# EasyEDA Pro project Avian.epro, board PCB1_1
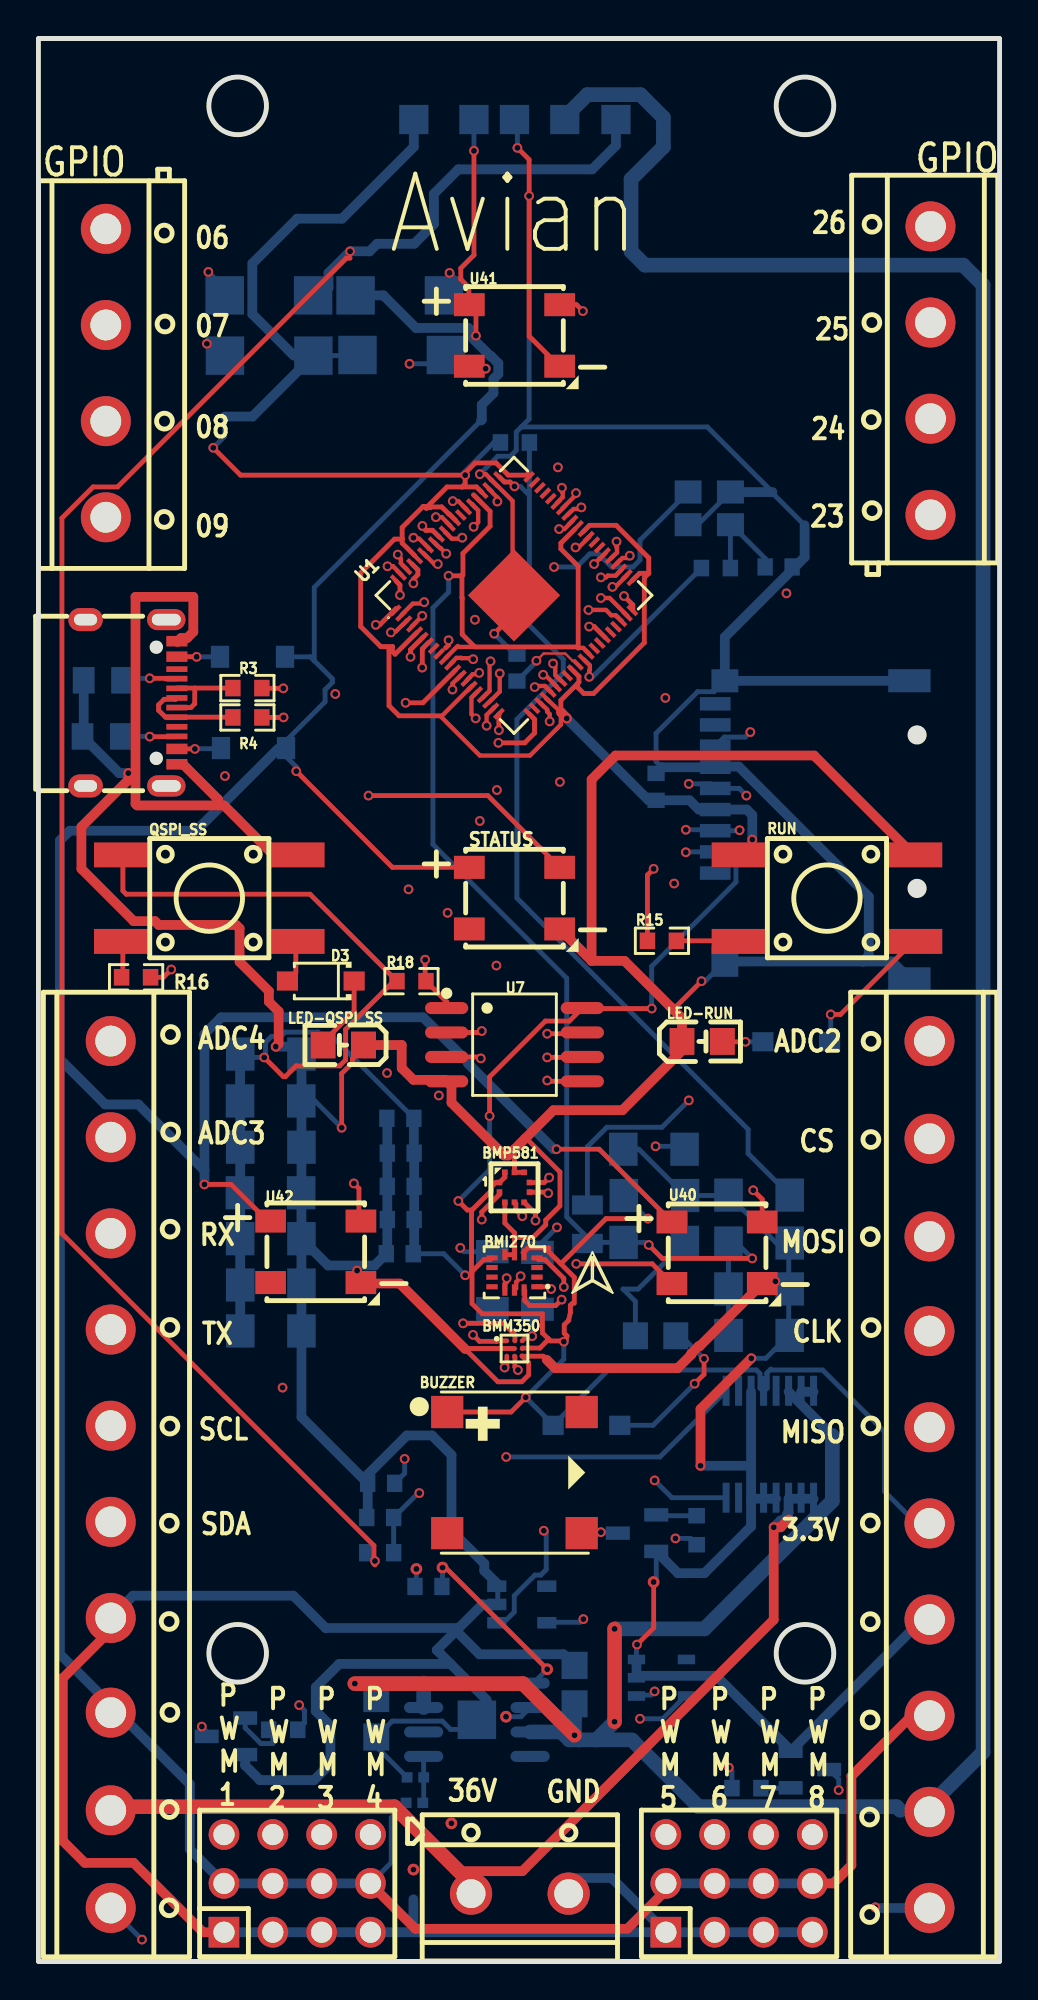
[diagram p2: board, top side]
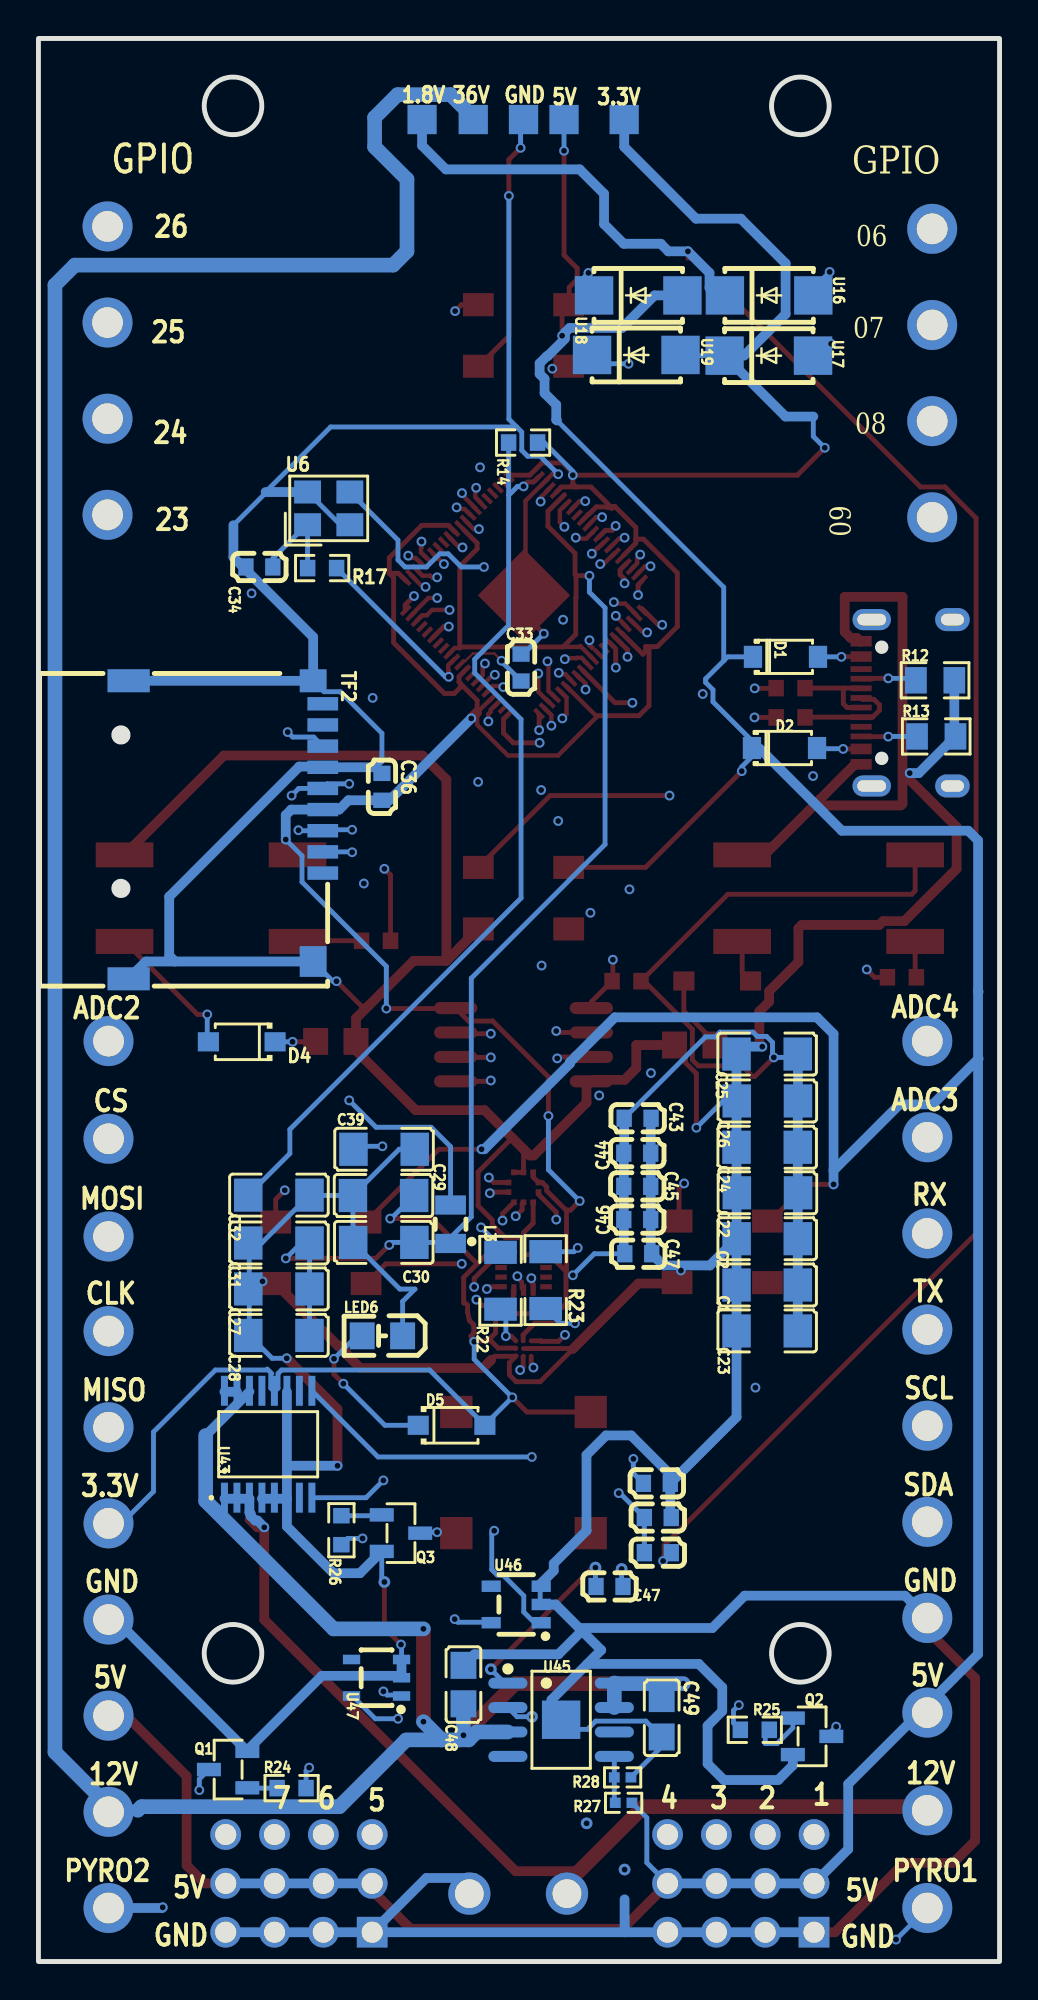
[diagram p3: board, bottom side, seen from below]

Outline 50 x 100 mm; copper layers: Top Layer, Inner1, Inner2, Inner3, Inner4, Bottom Layer. Coordinates in mm from the lower left corner of the outline.
Outline path: rectangle 0,100 50,0 ; circle c10.36,96.5 r1.5 ; circle c10.36,16.03 r1.5 ; circle c39.88,96.5 r1.5 ; circle c39.88,16.03 r1.5
Stack: Top Layer 0.035mm Outer layer thickness 1oz / Dielectric1 0.0994mm 3313 RC57% 4.2mil / Inner1 0.0152mm Inner layer thickness / Dielectric2 0.55mm 0.55mm H/H No copper / Inner2 0.0152mm Inner layer thickness / Dielectric3 0.1088mm 2116 RC54% 4.9mil / Inner3 0.0152mm Inner layer thickness / Dielectric4 0.55mm 0.55mm H/H No copper / Inner4 0.0152mm Inner layer thickness / Dielectric5 0.0994mm 3313 RC57% 4.2mil / Bottom Layer 0.035mm Outer layer thickness 1oz

## Design rules (mm)
template: JLCPCB Capability(Two Layers Board)
spacing copperThickness1oz (default): track to track 0.102, other pairs 0.152 to 0.3
spacing copperThickness2oz: track to track 0.203, other pairs 0.152 to 0.3
track width copperThickness1oz (default): min 0.127, default 0.254, max 2.54
track width copperThickness2oz: min 0.203, default 0.254, max 2.54
differential pair differentialPair (default): width min 0.127, default 0.254, max 2.54; gap min 0.152, default 0.152
via viaSize (default): diameter min 0.5, default 0.61, max 10; hole min 0.3, default 0.305, max 6.3

## Placement (name value [footprint] x y rotation side)
BMI270  BMI270  [LGA-14_L3.0-W2.5-P0.50-BR]  24.76 35.84 0 top
BMM350  BMM350  [WLCSP-9_L1.3-W1.3-R3-C3-P0.40-TL]  24.76 31.88 0 top
BMP581  BMP581  [LGA-10_L2.0-W2.0-P0.50-TL_BMP581]  24.76 40.26 0 top
BUZZER  2.7kHz  [BUZ-SMD_4P-L7.5-W7.5-P7.59-TL]  24.76 25.43 0 top
C1  100uF  [C1206]  12.09 35.18 180 bottom
C2  100uF  [C1206]  12.09 37.59 180 bottom
C22  100uF  [C1206]  12.08 39.97 180 bottom
C23  100uF  [C1206]  12.09 32.79 180 bottom
C24  100uF  [C1206]  12.09 42.34 180 bottom
C25  100uF  [C1206]  12.09 47.19 180 bottom
C26  100uF  [C1206]  12.08 44.75 180 bottom
C27  100uF  [C1206]  37.49 34.98 180 bottom
C28  100uF  [C1206]  37.49 32.56 180 bottom
C29  4.7uF  [C1206]  32.05 39.83 180 bottom
C30  4.7uF  [C1206]  32.03 37.4 180 bottom
C31  4.7uF  [C1206]  37.49 37.36 180 bottom
C32  4.7uF  [C1206]  37.49 39.85 180 bottom
C33  15pF  [C0603]  24.89 67.28 270 bottom
C34  15pF  [C0603]  38.51 72.52 180 bottom
C35  100nF  [C0603]  18.8 36.81 180 bottom
C36  100nF  [C0603]  32.13 61.09 270 bottom
C39  2.2uF  [C1206]  32.02 42.24 180 bottom
C40  10nF  [C0603]  17.78 21.26 180 bottom
C41  100nF  [C0603]  18.85 40.31 180 bottom
C42  100nF  [C0603]  18.85 38.58 0 bottom
C43  100nF  [C0603]  18.83 43.85 180 bottom
C44  100nF  [C0603]  18.85 42.04 0 bottom
C45  100nF  [C0603]  17.83 24.87 180 bottom
C46  100nF  [C0603]  17.78 23.09 0 bottom
C47  100nF  [C0603]  20.29 19.51 0 bottom
C48  10uF  [C0805]  27.89 14.4 90 bottom
C49  10uF  [C0805]  17.58 12.68 270 bottom
D1  MM1Z5V6  [SOD-123_L2.8-W1.8-LS3.7-RD]  11.14 67.84 180 bottom
D2  MM1Z5V6  [SOD-123_L2.8-W1.8-LS3.7-RD]  11.19 63.1 180 bottom
D3  1N4148W  [SOD-123F_L2.7-W1.6-LS3.8-RD]  14.69 50.99 180 top
D4  1N4148W  [SOD-123F_L2.7-W1.6-LS3.8-RD]  39.42 47.83 0 bottom
D5  1N4148W  [SOD-123F_L2.7-W1.6-LS3.8-RD]  28.51 27.88 180 bottom
L3  3.3uH  [IND-SMD_L2.0-W1.6_AOTA-B201610S3R3-101-T]  28.56 38.34 270 bottom
LED6  YLED0805G  [LED0805-FD-GREEN]  32.11 32.54 180 bottom
LED-QSPI_SS  YLED0805G  [LED0805-FD-GREEN]  15.86 47.66 0 top
LED-RUN  YLED0805G  [LED0805-FD-GREEN]  34.53 47.84 180 top
NOREF  -  [Pad_e3777]  30.04 95.78 0 top
NOREF#2  -  [Pad_e3781]  19.53 95.78 0 top
NOREF#3  -  [Pad_e3780]  22.66 95.78 0 top
NOREF#4  -  [Pad_e3778]  27.38 95.78 0 top
NOREF#5  -  [Pad_e3779]  24.76 95.78 0 top
Q1  AO3400A  [SOT-23-3_L2.9-W1.3-P1.90-LS2.4-BR]  40.13 9.98 180 bottom
Q2  AO3400A  [SOT-23-3_L2.9-W1.3-P1.90-LS2.4-BR]  9.75 11.71 0 bottom
Q3  AO3400A  [SOT-23-3_L2.9-W1.3-P1.90-LS2.4-BR]  31.14 22.28 0 bottom
QSPI_SS  KSC441G70SHLFS  [KEY--SMD_4P-L6.2-W6.2-P4.50-LS12.0]  8.89 55.3 0 top
R3  261kΩ  [R0603]  10.87 66.22 0 top
R4  261kΩ  [R0603]  10.87 64.69 0 top
R12  5.1kΩ  [R0805]  3.35 66.62 180 bottom
R13  5.1kΩ  [R0805]  3.29 63.71 180 bottom
R14  33Ω  [R0603]  24.79 78.99 0 bottom
R15  1kΩ  [R0603]  32.44 53.08 180 top
R16  1kΩ  [R0603]  5.08 51.18 0 top
R17  1kΩ  [R0603]  35.24 72.46 0 bottom
R18  10kΩ  [R0603]  19.41 50.98 180 top
R22  4.7kΩ  [R1206]  25.96 35.4 270 bottom
R23  4.7kΩ  [R1206]  23.61 35.43 270 bottom
R24  10kΩ  [R0603]  36.83 9.02 0 bottom
R25  10kΩ  [R0603]  12.73 12.05 180 bottom
R26  10kΩ  [R0603]  34.24 22.43 90 bottom
R27  44.2kΩ  [R0402]  19.56 8.25 180 bottom
R28  6.04kΩ  [R0402]  19.61 9.58 180 bottom
RUN  KSC441G70SHLFS  [KEY--SMD_4P-L6.2-W6.2-P4.50-LS12.0]  41.02 55.3 0 top
STATUS  WS2812  [LED-SMD_4P-L5.0-W5.0-TL-A]  24.76 55.3 0 top
TF2  TF-CARD H1.8  [TF-SMD_TF-CARD-H1.8]  40.26 58.85 270 bottom
U1  RP2350B  [QFN-80_L10.0-W10.0-P0.40-TL-EP3.4]  24.74 71.04 45 top
U2  JL301-50002U04  [CONN-TH_JL301-50002U01]  25.04 3.53 0 top
U6  ABM8-272-T3  [CRYSTAL-SMD_4P-L3.2-W2.5-BL]  34.9 75.56 180 bottom
U7  W25Q128JVSIQ  [SOIC-8_L5.3-W5.3-P1.27-LS8.0-BL]  24.76 47.68 270 top
U16  CDBA140SL-HF  [DO-214AC_L4.3-W2.7-LS5.3-RD]  11.99 86.64 180 bottom
U17  CDBA140SL-HF  [DO-214AC_L4.3-W2.7-LS5.3-RD]  12 83.51 180 bottom
U18  CDBA140SL-HF  [DO-214AC_L4.3-W2.7-LS5.3-RD]  18.8 86.64 180 bottom
U19  CDBA140SL-HF  [DO-214AC_L4.3-W2.7-LS5.3-RD]  18.9 83.54 180 bottom
U33  JL301-50010U02  [CONN-TH_10P-P5.00_JL301-50010U02]  3.76 25.32 90 top
U34  JL301-50010U02  [CONN-TH_10P-P5.00_JL301-50010U02]  46.35 25.32 270 top
U35  JL301-50004U02  [CONN-TH_4P-P5.00_JL301-50004U02]  46.41 82.73 270 top
U36  JL301-50004U02  [CONN-TH_4P-P5.00_JL301-50004U02]  3.5 82.6 90 top
U37  HX PZ2.54-3x4P ZZ  [HDR-TH_12P-P2.54-V-M-R3-C4-S2.54]  13.46 4.06 0 top
U38  HX PZ2.54-3x4P ZZ  [HDR-TH_12P-P2.54-V-M-R3-C4-S2.54]  36.45 4.06 0 top
U40  WS2812  [LED-SMD_4P-L5.0-W5.0-TL-A]  35.31 36.86 0 top
U41  WS2812  [LED-SMD_4P-L5.0-W5.0-TL-A]  24.76 84.56 0 top
U42  WS2812  [LED-SMD_4P-L5.0-W5.0-TL-A]  14.43 36.91 0 top
U43  INA260AIPWR  [TSSOP-16_L5.0-W4.4-P0.65-LS6.4-BL-1]  38.05 26.9 180 bottom
U45  SY8205FCC  [SOIC-8_L5.0-W4.0-P1.27-LS6.0-BL-EP2.0]  22.81 12.57 270 bottom
U46  AP2112K-3.3TRG1(MS)  [SOT-23-5_L2.9-W1.6-P0.95-LS2.7-BR]  25.15 18.57 180 bottom
U47  AP2112K-1.8TRG1  [SOT-25_L3.0-W1.6-P0.95-LS2.8-BL]  32.41 14.76 90 bottom
USB1  TYPE-C 16PIN 2MD(073)  [USB-C-SMD_TYPE-C-6PIN-2MD-073]  4.83 65.46 270 top

## Footprints (pads in the part's own frame, mm; a bottom-side part is the same pattern mirrored in y, then rotated)
BUZ-SMD_4P-L7.5-W7.5-P7.59-TL
  rect 1.681x1.68 smd: 1(-3.498,3.15) 2(-3.498,-3.15) 3(3.498,-3.15) 4(3.498,3.15)
C0603
  rect 0.8x0.9 smd: 1(-0.7,0) 2(0.7,0)
C0805
  rect 1.41x1.35 smd: 1(-1,0) 2(1,0)
C1206
  rect 1.485x1.728 smd: 1(-1.593,0) 2(1.593,0)
CONN-TH_4P-P5.00_JL301-50004U02
  round 2.6 hole 1.6: 1(-7.5,0) 2(-2.5,0) 3(2.5,0) 4(7.5,0)
CONN-TH_10P-P5.00_JL301-50010U02
  round 2.6 hole 1.6: 1(-22.54,0) 2(-17.46,0) 3(-12.38,0) 4(-7.46,0) 5(-2.46,0) 6(2.54,0) 7(7.54,0) 8(12.54,0) 9(17.54,0) 10(22.54,0)
CONN-TH_JL301-50002U01
  round 2.2 hole 1.5: 1(-2.54,0) 2(2.54,0)
CRYSTAL-SMD_4P-L3.2-W2.5-BL
  rect 1.4x1.2 smd: 1(-1.1,-0.85) 2(1.1,-0.85) 3(1.1,0.85) 4(-1.1,0.85)
DO-214AC_L4.3-W2.7-LS5.3-RD
  rect 2x2 smd: 1(-2.3,0) 2(2.3,0)
HDR-TH_12P-P2.54-V-M-R3-C4-S2.54
  rect 1.6x1.6 hole 1.1: 1(-3.81,-2.54)
  round 1.6 hole 1.1: 2(-3.81,0) 3(-3.81,2.54) 4(-1.27,-2.54) 5(-1.27,0) 6(-1.27,2.54) 7(1.27,-2.54) 8(1.27,0) 9(1.27,2.54) 10(3.81,-2.54) 11(3.81,0) 12(3.81,2.54)
IND-SMD_L2.0-W1.6_AOTA-B201610S3R3-101-T
  rect 1x1.6 smd: 1(-1,0) 2(1,0)
KEY--SMD_4P-L6.2-W6.2-P4.50-LS12.0
  rect 3x1.3 smd: 1(-4.5,2.25) 2(4.5,2.25) 3(-4.5,-2.25) 4(4.5,-2.25)
LED0805-FD-GREEN
  rect 1.3x1.399 smd: 1(-1.05,0) 2(1.05,0)
LED-SMD_4P-L5.0-W5.0-TL-A
  rect 1.6x1.2 smd: 1(-2.35,1.6) 2(-2.35,-1.6) 3(2.35,-1.6) 4(2.35,1.6)
LGA-10_L2.0-W2.0-P0.50-TL_BMP581
  rect 0.3x0.3 smd: 1(-0.78,0.25) 2(-0.78,-0.25) 3(-0.5,-0.78) 4(0,-0.78) 5(0.5,-0.78) 6(0.78,-0.25) 7(0.78,0.25) 8(0.5,0.78) 9(0,0.78) 10(-0.5,0.78)
LGA-14_L3.0-W2.5-P0.50-BR
  rect 0.6x0.27 smd: 1(1.17,-0.75) 2(1.17,-0.25) 3(1.17,0.25) 4(1.17,0.75) 8(-1.17,0.75) 9(-1.17,0.25) 10(-1.17,-0.25) 11(-1.17,-0.75)
  rect 0.27x0.6 smd: 5(0.5,0.92) 6(0,0.92) 7(-0.5,0.92) 12(-0.5,-0.92) 13(0,-0.92) 14(0.5,-0.92)
Pad_e3777
  rect 1.524x1.524 smd far side: 1(0,0)
Pad_e3778
  rect 1.524x1.524 smd far side: 2(0,0)
Pad_e3779
  rect 1.524x1.524 smd far side: 3(0,0)
Pad_e3780
  rect 1.524x1.524 smd far side: 4(0,0)
Pad_e3781
  rect 1.524x1.524 smd far side: 5(0,0)
QFN-80_L10.0-W10.0-P0.40-TL-EP3.4
  rect 0.665x0.22 smd: 1(-4.907,3.8) 2(-4.907,3.4) 3(-4.907,3) 4(-4.907,2.6) 5(-4.907,2.2) 6(-4.907,1.8) 7(-4.907,1.4) 8(-4.907,1) 9(-4.907,0.6) 10(-4.907,0.2) 11(-4.907,-0.2) 12(-4.907,-0.6) 13(-4.907,-1) 14(-4.907,-1.4) 15(-4.907,-1.8) 16(-4.907,-2.2) 17(-4.907,-2.6) 18(-4.907,-3) 19(-4.907,-3.4) 20(-4.907,-3.8) 41(4.907,-3.8) 42(4.907,-3.4) 43(4.907,-3) 44(4.907,-2.6) 45(4.907,-2.2) 46(4.907,-1.8) 47(4.907,-1.4) 48(4.907,-1) 49(4.907,-0.6) 50(4.907,-0.2) 51(4.907,0.2) 52(4.907,0.6) 53(4.907,1) 54(4.907,1.4) 55(4.907,1.8) 56(4.907,2.2) 57(4.907,2.6) 58(4.907,3) 59(4.907,3.4) 60(4.907,3.8)
  rect 0.22x0.665 smd: 21(-3.8,-4.907) 22(-3.4,-4.907) 23(-3,-4.907) 24(-2.6,-4.907) 25(-2.2,-4.907) 26(-1.8,-4.907) 27(-1.4,-4.907) 28(-1,-4.907) 29(-0.6,-4.907) 30(-0.2,-4.907) 31(0.2,-4.907) 32(0.6,-4.907) 33(1,-4.907) 34(1.4,-4.907) 35(1.8,-4.907) 36(2.2,-4.907) 37(2.6,-4.907) 38(3,-4.907) 39(3.4,-4.907) 40(3.8,-4.907) 61(3.8,4.907) 62(3.4,4.907) 63(3,4.907) 64(2.6,4.907) 65(2.2,4.907) 66(1.8,4.907) 67(1.4,4.907) 68(1,4.907) 69(0.6,4.907) 70(0.2,4.907) 71(-0.2,4.907) 72(-0.6,4.907) 73(-1,4.907) 74(-1.4,4.907) 75(-1.8,4.907) 76(-2.2,4.907) 77(-2.6,4.907) 78(-3,4.907) 79(-3.4,4.907) 80(-3.8,4.907)
  rect 3.4x3.4 smd: 81(0,0)
R0402
  rect 0.566x0.54 smd: 1(-0.433,0) 2(0.433,0)
R0603
  rect 0.806x0.864 smd: 1(-0.753,0) 2(0.753,0)
R0805
  rect 1.133x1.377 smd: 1(-1,0) 2(1,0)
R1206
  rect 1.208x1.701 smd: 1(-1.479,0) 2(1.479,0)
SOD-123_L2.8-W1.8-LS3.7-RD
  rect 0.95x1.15 smd: 1(-1.692,0) 2(1.692,0)
SOD-123F_L2.7-W1.6-LS3.8-RD
  rect 1.1x1 smd: 1(-1.735,0) 2(1.735,0)
SOIC-8_L5.0-W4.0-P1.27-LS6.0-BL-EP2.0
  oval 0.574x2.038 smd: 1(-1.905,-2.769) 2(-0.635,-2.769) 3(0.635,-2.769) 4(1.905,-2.769) 5(1.905,2.769) 6(0.635,2.769) 7(-0.635,2.769) 8(-1.905,2.769)
  rect 2x2 smd: 9(0,0)
SOIC-8_L5.3-W5.3-P1.27-LS8.0-BL
  oval 0.63x2.25 smd: 1(-1.905,-3.53) 2(-0.635,-3.53) 3(0.635,-3.53) 4(1.905,-3.53) 5(1.905,3.53) 6(0.635,3.53) 7(-0.635,3.53) 8(-1.905,3.53)
SOT-23-3_L2.9-W1.3-P1.90-LS2.4-BR
  rect 1.25x0.7 smd: 1(1,-0.95) 2(1,0.95) 3(-1,0)
SOT-23-5_L2.9-W1.6-P0.95-LS2.7-BR
  rect 1x0.6 smd: 1(1.3,-0.95) 2(1.3,0) 3(1.3,0.95) 4(-1.3,0.95) 5(-1.3,-0.95)
SOT-25_L3.0-W1.6-P0.95-LS2.8-BL
  rect 0.5x0.9 smd: 1(-0.95,-1.3) 2(0,-1.3) 3(0.95,-1.3) 4(0.95,1.3) 5(-0.95,1.3)
TF-SMD_TF-CARD-H1.8
  rect 0.7x1.6 smd: 1(2.25,5.05) 2(1.15,5.05) 3(0.05,5.05) 4(-1.05,5.05) 5(-2.15,5.05) 6(-3.25,5.05) 7(-4.35,5.05) 8(-5.45,5.05) 9(-6.55,5.05)
  rect 1.2x1.4 smd: 10(-7.747,4.55)
  rect 1.2x2.2 smd: 11(-7.75,-5.05) 12(7.75,-5.05)
  rect 1.6x1.4 smd: 13(6.85,4.55)
TSSOP-16_L5.0-W4.4-P0.65-LS6.4-BL-1
  rect 0.364x1.56 smd: 1(-2.275,-2.78) 2(-1.625,-2.78) 3(-0.975,-2.78) 4(-0.325,-2.78) 5(0.325,-2.78) 6(0.975,-2.78) 7(1.625,-2.78) 8(2.275,-2.78) 9(2.275,2.78) 10(1.625,2.78) 11(0.975,2.78) 12(0.325,2.78) 13(-0.325,2.78) 14(-0.975,2.78) 15(-1.625,2.78) 16(-2.275,2.78)
USB-C-SMD_TYPE-C-6PIN-2MD-073
  rect 0.55x1.1 smd: 1(-3.2,2.375) 2(-2.4,2.375) 11(2.4,2.375) 12(3.2,2.375)
  rect 0.3x1.1 smd: 3(-1.75,2.375) 4(-1.25,2.375) 5(-0.75,2.375) 6(-0.25,2.375) 7(0.25,2.375) 8(0.75,2.375) 9(1.25,2.375) 10(1.75,2.375)
  oval 1.1x2 hole 0.6x1.5: 13(-4.325,1.825) 14(4.325,1.825)
  oval 1.2x1.8 hole 0.6x1.2: 13(-4.325,-2.375) 14(4.325,-2.375)
WLCSP-9_L1.3-W1.3-R3-C3-P0.40-TL
  round 0.2 smd: A1(-0.4,0.4) A2(0,0.4) A3(0.4,0.4) B1(-0.4,0) B2(0,0) B3(0.4,0) C1(-0.4,-0.4) C2(0,-0.4) C3(0.4,-0.4)

## Nets
1.1V: C27.2 C28.2 C30.2 C31.2 L3.2 U1.10 U1.32 U1.51 U1.65
1.8V: C40.2 NOREF.1 U16.1
3.3V: BMI270.5 BMI270.8 BMM350.B3 BMP581.1 BMP581.10 BUZZER.1 C1.2 C2.2 C22.2 C23.2 C24.2 C25.2 C26.2 C29.2 C35.1 C36.2 C41.1 C42.2 C43.1 C44.2 D5.2 NOREF#2.5 QSPI_SS.1 R14.1 R18.2 RUN.1 TF2.4 U1.5 U1.15 U1.24 U1.29 U1.41 U1.50 U1.60 U1.64 U1.69 U1.76 U7.8 U17.1 U19.2 U34.6 U43.12
+5V: D1.1 D2.1 NOREF#3.4 R27.2 STATUS.1 U18.2 U33.3 U34.8 U37.2 U37.5 U37.8 U37.11 U38.2 U38.5 U38.8 U38.11 U40.1 U41.1 U42.1
GND: BMI270.6 BMI270.7 BMM350.B1 BMM350.B2 BMM350.C3 BMP581.3 BMP581.8 BMP581.9 C1.1 C2.1 C22.1 C23.1 C24.1 C25.1 C26.1 C27.1 C28.1 C29.1 C30.1 C31.1 C32.2 C33.1 C34.1 C35.2 C36.1 C39.2 C41.2 C42.1 C43.2 C44.1 C45.2 C46.1 C48.2 C49.2 LED6.2 LED-QSPI_SS.2 LED-RUN.2 NOREF#5.3 Q1.2 Q2.2 Q3.2 QSPI_SS.2 R12.2 R13.2 R28.2 RUN.2 STATUS.3 TF2.6 TF2.10 TF2.11 TF2.12 TF2.13 U1.62 U1.81 U2.2 U6.2 U6.4 U7.4 U33.4 U34.7 U37.1 U37.4 U37.7 U37.10 U38.1 U38.4 U38.7 U38.10 U40.3 U41.3 U42.3 U43.4 U43.5 U43.6 U43.11 U45.9 U46.2 U46.3 U47.2 U47.3 USB1.1 USB1.12
VCC: C48.1 C49.1 NOREF#4.2 U2.1 U33.2 U34.9 U43.1 U43.2 U43.3 U43.14 U43.15 U43.16 U45.3 U45.7 U45.8
ADC0: R24.1 U1.49
ADC1: R25.1 U1.52
ADC2: U1.53 U34.1
ADC3: U1.54 U33.9
ADC4: U1.55 U33.10
BUZ: R26.1 U1.1
CLK: TF2.5 U1.13 U34.4
CS: U1.9 U34.2
GPIO0: R23.1 U1.77
GPIO1: R22.1 U1.78
GPIO6: U1.3 U36.4
GPIO7: U1.4 U36.3
GPIO8: U1.6 U36.2
GPIO9: U1.7 U36.1
GPIO13: BMP581.6 U1.12
GPIO16: BMI270.1 BMP581.5 U1.16
GPIO17: BMI270.12 U1.17
GPIO18: BMI270.13 BMP581.2 U1.18
GPIO19: BMI270.14 BMP581.4 U1.19
GPIO20: BMI270.4 U1.20
GPIO21: BMP581.7 U1.21
GPIO22: U1.22
GPIO23: U1.23 U35.4
GPIO24: U1.25 U35.3
GPIO25: U1.26 U35.2
GPIO26: U1.27 U35.1
MISO: TF2.7 U1.11 U34.5
MOSI: TF2.3 U1.14 U34.3
NEOIN: U1.80 U40.4
PISTA: STATUS.4 U1.79
PWM1: U1.38 U37.3
PWM2: U1.39 U37.6
PWM3: U1.40 U37.9
PWM4: U1.42 U37.12
PWM5: U1.43 U38.3
PWM6: U1.44 U38.6
PWM7: U1.45 U38.9
PWM8: U1.46 U38.12
QSPI_SCLK: U1.71 U7.6
QSPI_SD1: U1.74 U7.2
QSPI_SD2: U1.73 U7.3
QSPI_SD3: U1.70 U7.7
QSPI_SDO: U1.72 U7.5
QSPI_SS: R16.2 R18.1 U1.75 U7.1
RPD+: R4.1 USB1.6 USB1.8
RPD-: R3.1 USB1.5 USB1.7
RX: U33.8
SCL: U33.6 U43.9
SDA: U33.5 U43.8
SDCS: TF2.2 U1.2
TX: U33.7
XIN: C33.2 U1.30 U6.3
XOUT: R17.1 U1.31
$3N4153: BMM350.C2 C39.1
$3N4271: BMM350.C1 C40.1 C46.2
$3N4404: BMM350.A3 R22.2
$3N4443: BMM350.A2 R23.2
$3N5055: BMM350.A1 C45.1
$3N22326: BUZZER.3 Q3.3
$3N22330: Q3.1 R26.2
$3N25501: Q1.3 U34.10
$3N25503: Q1.1 R24.2
$3N26223: Q2.1 R25.2
$3N26229: Q2.3 U33.1
$3N29548: C47.2 U45.1
$3N29821: U17.2 U46.5
$3N29823: U18.1 U46.1
$3N29825: U16.2 U47.5
$3N29827: U19.1 U47.1
$3N29841: C47.1 U45.2
$3N29881: R27.1 R28.1 U45.5
$5N714: R3.2 U1.66
$5N753: R4.2 U1.67
$5N865: R12.1 USB1.4
$5N907: R13.1 USB1.10
$5N1500: L3.1 U1.63
$5N1577: C32.1 R14.2 U1.61
$5N3555: R15.2 U1.35
$5N4153: D4.1 LED-RUN.1
$5N4199: D3.1 LED-QSPI_SS.1
$5N4367: D5.1 LED6.1
$5N4916: C34.2 R17.2 U6.1
$5N10092: QSPI_SS.3 R16.1
$5N10100: D3.2 QSPI_SS.4
$5N12881: R15.1 RUN.3
$5N12933: D4.2 RUN.4
$5N18524: U40.2 U41.4
$5N18586: U41.2 U42.4
$5N24177: D1.2 USB1.2
$5N24251: D2.2 USB1.11

Pads without a net: BMI270 2 3 9 10 11; BUZZER 2 4; STATUS 2; TF2 1 8 9; U1 8 28 33 34 36 37 47 48 56 57 58 59 68; U42 2; U43 7 10 13; U45 4 6; U46 4; U47 4; USB1 3 9 13 14

## Via types
v1: diameter 0.508, hole 0.305, Top Layer to Bottom Layer, 176 vias
v2: diameter 0.61, hole 0.305, Top Layer to Bottom Layer, 8 vias

## Routing (per net, layer and track width the routed paths; a pad name or vN(x,y) marks a point on that pad's centre or on a via; arc(x,y) is an arc through that point)
1.1V: length 78.4
  Top Layer w0.229: 28.66,68 28.35,68.31 28.08,68.31 ; 21.81,68.36 22.75,68.36 ; 21.17,67.77 21.81,68.41
  Top Layer w0.254: v1(37.13,36.56) 32.45,36.56 v1(31.75,37.26) ; 22.03,72.06 22.08,72.12 22.08,73.22 23.5,74.64 23.5,75.41 22.63,76.27 ; 22.03,72.06 22.03,70.93 22.05,70.91 22.05,69.01 22.7,68.36 ; 22.03,72.06 22.03,72.12 ; 22.03,72.06 22.03,72.06 v1(21.34,72.06) ; 22.75,68.36 28.03,68.36 28.08,68.31 28.08,72.55 27.18,73.46 27.18,73.76 27.91,74.48
  Bottom Layer w0.254: v1(21.34,72.06) 21.34,71.2 20.52,70.39 20.52,58.09 27.48,51.13 27.48,38.72 28.56,37.65 L3.2 28.62,37.4 C30.2 31.62,37.4 v1(31.75,37.26) ; C28.2 C27.2 C31.2 36.33,37.36 v1(37.13,36.56)
1.8V: length 103.5
  Top Layer w0.254: 17.5,20.62 17.45,20.68 17.45,21.63 1.22,37.86 1.22,75.06 2.84,76.68 4.11,76.68 16.01,88.57 16.21,88.57
  Bottom Layer w0.508: NOREF.1 30.04,94.43 28.8,93.19 21.84,93.19 20.57,91.92 20.57,90.35 19.55,89.32 17.62,89.32 17.23,88.93 v1(16.21,88.93) 15.09,87.81 15.09,87.03 14.69,86.64 14.29,86.64
  vias: v1(17.5,20.83)
3.3V: length 279.6
  Top Layer w0.229: 27.18,64.97 27.18,64.32 25.57,62.71 22.96,62.71 20.94,64.73 22.57,66.35 ; 27.18,64.97 26.41,65.68 ; 27.18,64.97 27.2,64.94
  Top Layer w0.254: 31.75,72.19 31.52,71.96 31.52,68.58 28.88,65.94 28.37,65.94 28.04,66.27 28.04,66.45 ; 31.75,72.19 31.27,72.19 30.88,71.8 ; 31.75,72.19 31.75,72.99 30.06,74.68 28.67,74.68 28.32,74.33 ; QSPI_SS.1 4.39,57.54 4.39,55.68 4.57,55.5 14.13,55.5 R18.2 18.48,50.98 15.98,48.47 15.98,46.88 15.67,46.58 13.4,46.58 12.84,46.02 12.74,46.02 v1(11.74,47.01) ; v1(22.2,77.29) 22.2,77.41 22.72,77.93 23.81,77.93 24.44,77.29 25.46,77.29 ; v1(22.2,77.29) 22.2,76.84 22.04,76.68 ; v1(22.2,77.29) 10.52,77.29 v1(9.09,78.72) ; BMI270.8 23.51,36.5 23.18,36.5 22.56,35.88 ; 25.21,36.86 25.22,36.86 25.47,37.11 26.55,37.11 26.55,36.9 27.18,36.28 ; 26.52,32.39 26.52,32.33 26.08,31.9 25.19,31.9 BMM350.B3 ; 26.52,32.39 26.22,32.69 26.22,33.68 23.08,33.68 22.56,34.21 22.56,35.88 ; 26.52,32.39 26.64,32.27 27.29,32.27 ; 27.18,64.97 27.18,65.58 28.04,66.45 ; 27.68,67.27 28.12,66.83 28.12,66.53 28.04,66.45 ; 18.41,68.38 17.81,68.38 16.76,69.42 16.76,72.21 18.52,73.97 18.92,73.97 ; 18.41,68.38 18.24,68.2 18.24,65.3 18.76,64.78 20.94,64.78 ; 18.41,68.38 18.41,68.12 18.56,67.98 19.67,69.1 ; BUZZER.1 24.59,28.58 v1(25.35,29.34) ; 25.55,77.25 25.46,77.34 ; 23.08,76.39 22.79,76.68 22.04,76.68 ; 19.56,73.12 18.92,73.76 18.92,73.97 ; 27.44,32.27 27.5,32.53 27.36,32.67 27.36,33.11 27.58,33.34 27.58,33.35 27.67,33.76 27.67,34.13 27.78,34.23 ; 22.56,35.88 22.53,35.91 22.53,39.05 22.56,39.08 ; 20.23,75.6 20.4,75.6 20.43,75.64 20.98,75.64 21.36,75.26 21.38,75.26 21.71,74.94 ; v1(37.13,58.34) 37.13,58.16 RUN.1 ; 27.28,32.23 27.29,32.27 ; 27.29,32.27 v1(27.33,32.23) ; 22.56,39.08 23.56,40.08 23.56,40.28 23.79,40.51 BMP581.1 24.26,40.79 BMP581.10 ; 22.56,39.08 22.31,39.08 v1(21.84,39.55) ; 22.04,76.68 21.25,76.68 20.23,75.65 ; 18.92,73.97 18.92,74.57 20.01,75.67 20.08,75.67 20.18,75.56 20.22,75.6 20.22,75.64 20.23,75.65 ; v1(31.7,38.63) 29.53,38.63 27.18,36.28 ; 27.18,36.28 27.88,35.58 27.88,34.23 ; 20.22,75.65 20.23,75.65 ; v1(31.9,49.56) 28.32,49.56 U7.8 27.62,48.91 26.37,48.91 23.47,46 v1(23.47,43.97)
  Top Layer w0.508: v1(27.48,64.64) 27.48,64.67 27.18,64.97
  Bottom Layer w0.254: v1(22.2,77.29) 22.2,77.5 23.69,78.99 R14.1 ; 45.59,22.86 44.01,24.44 44.01,27.54 40.79,30.76 38.15,30.76 ; v1(31.9,49.56) 31.9,51.75 36.29,56.14 36.29,57.5 v1(37.13,58.34) ; v1(27.33,32.23) 27.33,31.32 v1(25.35,29.34) 26.77,27.91 D5.2 29.65,30.76 37.35,30.76 37.53,30.57 37.53,29.82 37.72,29.63 37.91,29.82 37.91,30.52 ; U17.1 16.56,83.51 U19.2 ; C43.1 15.3,48.08 14.79,48.08 14.54,48.33 12.83,48.33 12.6,48.11 12.12,48.11 11.81,47.8 11.81,47.08 v1(11.74,47.01) 10.68,47.01 C25.2 ; C35.1 21.08,36.81 v1(22.2,35.69) ; v1(31.7,38.63) 31.65,38.63 30.45,39.83 ; v1(21.84,39.55) 23.47,41.17 v1(23.47,43.97) ; v1(9.09,78.72) 9.69,79.31 9.69,80.34 ; 38.1,30.81 37.86,30.57
  Bottom Layer w0.508: C35.1 19.55,36.86 C42.2 C41.1 C44.2 19.53,42.06 C43.1 ; NOREF#2.5 19.53,94.37 15.79,90.63 13.46,90.63 11.13,88.3 11.13,85.67 13.29,83.51 ; U17.1 11.14,80.34 9.69,80.34 ; v1(27.48,64.64) 31.74,60.39 33.87,60.39 34.36,59.9 TF2.4 36.85,59.9 37.13,59.61 v1(37.13,58.34) ; C25.2 10.49,47.18 C26.2 10.5,44.74 C24.2 10.5,39.99 C22.2 10.5,39.96 C2.2 10.5,37.58 C1.2 C23.2
+5V: length 232.5
  Top Layer w0.254: U40.1 29.17,42.24 v1(26.95,42.24) ; 11.98,38.46 10.02,40.41 v1(8.64,40.41) ; v1(22.76,84.54) 22.76,85.79 22.39,86.16 22.39,87.06 21.97,87.48 21.97,88.05 22.66,88.74 v1(22.66,94.16) ; STATUS.1 18.41,56.9 v1(13.41,61.9)
  Top Layer w0.508: 45.59,12.94 42.29,9.64 42.29,5 41.35,4.06 U38.11 ; 17.27,3.61 17.7,3.61 19.61,1.7 30.64,1.7 32.64,3.7 32.64,4.42
  Bottom Layer w0.254: 22.64,84.5 22.72,84.5 v1(22.76,84.54) ; R27.2 18.35,7.48 18.35,5.14 U37.11 ; v1(13.41,61.9) 13.41,62.13 12.47,63.07 14.91,65.51 14.91,66.13 15.29,66.51 15.29,66.7 14.35,67.64 ; 14.35,67.64 14.15,67.84 D1.1 ; 14.35,67.64 14.35,71.46 23.03,80.14 ; NOREF#3.4 v1(22.66,94.16)
  Bottom Layer w0.508: U38.2 U38.5 U38.8 U38.11 ; 22.6,84.39 23.5,83.49 23.54,83.49 23.93,83.1 23.93,82.56 23.67,82.3 23.67,81.56 23.06,80.95 23.06,80.17 23.03,80.14 ; 8.64,41.13 v1(8.64,40.41) ; 8.64,41.13 5.2,44.57 3.47,44.57 1.12,46.92 ; 8.64,41.13 8.64,48.23 9.5,49.1 20.01,49.1 22.35,46.76 22.35,46.69 26.8,42.24 v1(26.95,42.24) ; 1.12,46.92 1.12,50.46 ; 1.12,46.92 1.09,46.95 ; 1.12,46.92 1.12,15.98 7.87,9.23 7.87,5.84 U37.2 U37.5 U37.8 U37.11 ; 1.12,50.46 1.12,58.29 1.63,58.8 8.2,58.8 12.47,63.07 ; 1.12,50.46 1.09,50.43 ; U18.2 17.95,86.64 19.64,84.95 22.37,84.95 22.6,84.71 22.6,84.54
GND: length 543.3
  Top Layer w0.229: 23.58,77.04 23.27,77.34 v1(22.96,77.34) ; 23.58,77.04 23.56,77.04 ; 23.58,77.04 24.66,75.95 24.66,71.2
  Top Layer w0.254: BMP581.8 BMP581.9 24.76,42.24 ; 16.91,47.66 16.91,47.52 16.34,46.94 16.34,46.74 15.77,46.17 v1(15.77,43.36) ; 24.76,37.65 24.76,37.9 24.26,38.4 BMP581.3 ; 24.76,37.65 25.73,37.65 26.39,38.31 26.39,38.56 27.13,39.29 27.13,41.06 25.35,42.83 ; 24.76,37.65 BMI270.6 BMI270.7 ; v1(31.14,16.49) 32,17.35 v2(32,19.74) ; v1(24.92,94.31) 25.53,93.7 v1(25.53,91.81) 25.53,84.52 27.09,82.96 ; v1(34.49,50.98) 33.19,49.67 32.85,49.67 ; 26.44,31.29 26.26,31.48 25.19,31.48 ; BMM350.B2 BMM350.B1 22.23,31.88 22.2,31.85 23.9,30.15 25.15,30.15 25.5,30.51 25.5,31.14 BMM350.C3 25.15,31.49 ; 24.76,71.04 24.76,70.1 v1(23.71,69.05)
  Top Layer w0.508: 28.78,52.03 28.78,61.47 30.02,62.71 40.35,62.71 RUN.2 ; 28.78,52.03 30.49,52.03 32.85,49.67 33.48,49.05 33.48,47.37 30.38,44.27 26.8,44.27 25.35,42.83 24.76,42.24 24.44,41.92 24.23,41.92 21.49,44.66 21.49,45.52 21.24,45.77 ; 28.78,52.03 27.12,53.7 ; 9.34,60.12 9.34,60.44 7.52,62.26 USB1.12 ; 9.34,60.12 5.14,60.12 5.05,60.2 5.05,70.96 8.06,70.96 8.06,69.14 7.74,68.83 7.42,68.83 7.23,68.63 USB1.1 ; 9.34,60.12 9.66,60.12 12.23,57.55 QSPI_SS.2 ; 16.68,35.26 18.79,35.26 22.2,31.85 ; 4.32,17.78 1.27,14.74 1.27,6.27 2.41,5.13 4.95,5.13 8.56,1.52 U37.1 ; v1(4.67,61.8) 4.67,61.44 2.23,59 2.23,56.82 4.95,54.1 6.06,54.1 6.26,53.9 10.28,53.9 10.47,53.72 10.47,51.98 11.99,50.46 11.99,49.91 12.5,49.4 12.5,47.73 v1(12.34,47.57) ; 24.64,71.17 24.51,71.04 ; v1(37.08,31.37) 34.44,28.73 v1(34.44,25.78) ; 37.66,35.31 U40.3 34.4,32 34.35,32 33.97,31.62 33.97,31.56 33.26,30.86 26.87,30.86 26.44,31.29 ; 16.91,47.66 18.9,47.66 18.9,46.46 19.51,45.85 21.16,45.85
  Bottom Layer w0.254: 38.18,76.42 34.8,79.8 25.12,79.8 ; C29.1 35.88,39.83 C32.2 38.39,37.36 39.03,37.36 39.03,32.56 37.84,31.37 v1(37.08,31.37) ; C29.1 33.64,37.41 31.2,34.97 30.41,34.97 31.06,34.33 LED6.2 ; C29.1 31.23,42.24 C39.2 ; 36,76.42 34.3,74.72 U6.2 ; 23.9,19.62 23.9,18.67 ; v1(15.77,43.36) 14.38,44.75 C26.1 ; 31.11,15.76 31.11,16.46 v1(31.14,16.49) ; v2(32,19.74) 32.14,19.87 Q3.2 ; v1(24.92,94.31) 24.92,95.63 NOREF#5.3 ; C33.1 24.77,67.98 v1(23.71,69.05) ; TF2.10 35.14,66.03 34.29,66.03 32.13,63.87 32.13,62.4 32.31,62.22 32.31,61.97 ; v1(22.96,77.34) 23.9,78.28 24.55,78.28 24.86,78.58 24.86,79.54 25.12,79.8 ; TF2.13 34.69,50.98 v1(34.49,50.98) ; 25.12,79.8 25.53,80.2 v1(25.53,91.81) ; R28.2 17.58,11.18 C49.2 18.41,12.5 21.01,12.5 21.44,12.07 22.31,12.07 ; 39.86,74.69 38.18,76.36 ; 23.31,13.07 23.31,12.07
  Bottom Layer w0.508: C48.2 27.31,15.98 22.95,15.98 21.72,17.2 ; 21.87,17.34 14.94,17.34 13.26,19.03 4.92,19.03 U33.4 ; 21.87,17.34 21.72,17.2 ; 21.87,17.34 23.09,18.57 U46.2 ; R12.2 2.35,63.76 R13.2 4.2,61.8 v1(4.67,61.8) ; 21.72,17.2 20.72,16.2 21.44,15.48 ; v1(34.44,25.78) 37.05,25.78 37.07,25.8 ; 42.89,52 43.2,52.31 43.2,55.37 36.43,62.14 35.25,62.14 TF2.6 32.45,62.1 C36.1 ; 42.89,52 44.41,52 TF2.12 ; 42.89,52 TF2.13 ; 37.07,25.8 37.07,24.07 ; 37.07,25.8 37.07,29.63 ; 37.07,24.07 37.07,22.62 34.65,20.19 33.27,20.19 Q3.2 ; 37.07,24.07 38.37,24.07 ; 21.44,15.48 23.31,13.61 23.31,13.07 ; 21.44,15.48 15.64,15.48 14.43,14.26 14.43,13.02 15.19,12.26 15.19,10.29 14.34,9.44 11.52,9.44 10.75,10.2 Q2.2 ; 45.59,17.86 45.59,17.39 Q1.2 ; 27.31,4.34 29.82,4.34 U38.1 ; 19.51,1.52 U37.10 U37.7 U37.4 U37.1 ; 19.51,1.52 U38.1 ; 19.51,1.52 19.51,1.53 19.51,3.23 ; C2.1 15.07,36.19 17.49,36.19 18.15,36.86 C42.1 C41.2 C44.1 18.15,43.83 C43.2 ; C2.1 13.68,39.96 C22.1 13.68,39.99 C24.1 13.68,44.74 C26.1 13.69,44.76 C25.1 13.3,47.57 v1(12.34,47.57) ; C2.1 13.68,35.18 C1.1 C23.1 13.68,28.31 C45.2 ; C45.2 17.13,25.32 19.16,27.36 20.47,27.36 21.49,26.34 21.49,22.4 23.19,20.69 23.19,20.32 23.9,19.62 ; C45.2 17.13,23.14 C46.1 ; 39.86,74.69 39.86,73.02 35.71,68.88 TF2.10 ; U38.10 U38.7 U38.4 U38.1 ; 39.13,10.98 35.26,14.86 31.11,14.86 U47.3 ; 35.71,66.55 TF2.10 ; TF2.10 45.31,66.6 TF2.11 ; 38.18,76.42 36,76.42
  vias: v1(16.58,35.93) v1(38.34,35.37)
VCC: length 232.8
  Top Layer w0.508: 22.22,4.7 25.18,4.7 38.25,17.78 v1(38.25,22.58) 38.61,22.58 39.01,22.99
  Top Layer w0.762: 4.32,7.78 4.59,8.05 18.52,8.05 22.22,4.34 ; v2(27.89,11.77) 25.2,14.45 v1(16.46,14.45) ; v1(29.97,17.3) v1(29.97,12.47)
  Bottom Layer w0.508: 39.02,29.63 41.3,27.35 ; v1(38.25,22.58) 38.6,22.93 38.72,22.93 38.96,23.17 38.96,23.29 39.02,23.35 39.02,24.07 40.32,24.07 ; 44.83,7.86 45.59,7.86 ; 39.67,29.63 40.32,29.63
  Bottom Layer w0.762: 45.34,7.86 45.75,8.27 46.52,8.27 49.14,10.89 49.14,87.18 48.11,88.21 31.55,88.21 30.83,88.93 30.83,92.68 32.51,94.36 32.51,95.89 31.32,97.08 28.55,97.08 27.38,95.91 NOREF#4.2 ; 41.3,27.35 41.3,23.95 34.65,17.3 v1(29.97,17.3) ; 30.89,11.51 34.34,8.05 44.64,8.05 44.83,7.86 ; C48.1 v2(27.89,11.77) 28.13,11.53 ; 28.13,11.53 27.62,11.53 27.2,11.94 U45.3 ; 28.13,11.53 29.03,11.53 ; v1(29.97,12.47) 29.03,11.53 ; 29.03,11.53 30.87,11.53 ; v1(16.46,14.45) 20.01,14.45 U45.8 U45.7
ADC0: length 69.4
  Top Layer w0.229: v1(27.94,73.53) 28.1,73.53 28.66,74.09
  Inner3 w0.254: v1(27.94,73.53) 28.87,73.53 31.05,71.35 31.05,70.32 35.61,65.76 35.61,10.39 v1(35.92,10.08)
  Bottom Layer w0.254: v1(35.92,10.08) 36.08,9.92 R24.1
ADC1: length 69.7
  Top Layer w0.229: 27.81,74.94 27.36,74.49 v1(27.09,74.49)
  Inner4 w0.254: 27.24,74.49 23.42,70.67 23.42,69.66 21.68,67.92 21.68,67.12 22.17,66.62 22.17,59.98 13.74,51.55 13.74,13.51 v1(13.56,13.34)
  Bottom Layer w0.254: 13.49,12.05 13.84,12.41 13.84,13.06 v1(13.56,13.34)
ADC2: length 35.8
  Top Layer w0.229: v1(28.25,75.62) 28.16,75.53 27.84,75.53 27.53,75.22
  Inner3 w0.254: v1(28.25,75.62) 29.49,74.37 29.49,73.55 44.93,58.11 44.93,48.53 45.59,47.86
ADC3: length 44.5
  Top Layer w0.229: 27.97,76.41 27.97,76.28 27.25,75.56
  Inner4 w0.254: 4.22,42.78 20.55,59.12 20.55,69.04 27.86,76.36
  vias: v1(27.97,76.36)
ADC4: length 40.2
  Top Layer w0.229: 27.23,76.69 27.23,76.43 27.27,76.39 27.27,76.15 26.96,75.84
  Inner4 w0.254: 21.87,71.13 4.32,53.58 ; 4.32,53.58 4.32,53.73 ; 4.32,53.58 4.32,48.02 ; 27.23,76.79 26.88,77.14 26.48,77.14 21.87,72.53 21.87,71.28
  vias: v1(27.23,76.63)
BUZ: length 57
  Top Layer w0.254: 18.61,70.36 17.75,69.51 v1(17.55,69.51)
  Inner1 w0.254: v1(17.55,69.51) 17.12,69.08 17.12,68.4 33.14,52.38 v1(33.14,22)
  Bottom Layer w0.254: v1(33.14,22) 33.91,22 R26.1
CLK: length 52.9
  Top Layer w0.229: 22,66.92 21.54,66.45 21.54,66.2
  Inner1 w0.254: v1(21.54,66.14) 21.54,65.7 22.06,65.18 28.98,65.18 32.92,61.24 v1(33.83,61.24)
  Inner3 w0.254: v1(36.83,60.63) 37.39,60.63 38.48,59.54 38.48,53.3 48.56,43.22 48.56,37.54 46.41,35.38 46.41,32.61
  Bottom Layer w0.254: v1(33.83,61.24) 34.97,61.24 TF2.5 36.46,61 v1(36.83,60.63)
CS: length 37.9
  Top Layer w0.254: 21.18,68.31 21.34,68.46 v1(21.34,68.71)
  Inner1 w0.254: 21.34,68.66 21.18,68.5 21.18,66.85 20.7,66.37 20.7,65.84 43.93,42.61 45.44,42.61
GPIO0: length 50.9
  Top Layer w0.254: v1(19.51,71.67) 19.51,71.89 19.74,72.12 19.74,72.37 19.43,72.68
  Inner1 w0.254: v1(21.95,37.11) 20.63,37.11 6.38,51.37 6.38,51.81 9.7,55.14 v1(9.7,61.65)
  Inner4 w0.254: v1(9.7,61.65) 9.7,62.42 17.33,70.04 18.55,70.04 19.34,70.84 19.34,71.5 v1(19.51,71.67)
  Bottom Layer w0.254: v1(21.95,37.11) 22.14,36.91 R23.1
GPIO1: length 76.8
  Top Layer w0.229: 19.17,72.39 18.85,72.71 18.85,72.95 18.69,73.11 v1(18.69,73.16)
  Inner2 w0.254: v1(12.7,29.84) 20.8,37.95 26.75,37.95 v1(26.97,38.18)
  Inner4 w0.254: v1(12.7,29.84) 12.65,29.79 10.62,29.79 8.18,32.23 8.18,35.88 1.98,42.08 1.98,52.84 8.67,59.53 8.67,63.82 18.01,73.16 v1(18.69,73.16)
  Bottom Layer w0.254: v1(26.97,38.18) 25.96,37.16 R22.1
GPIO6: length 28.7
  Top Layer w0.229: 19.17,69.75 18.59,69.16 18.34,69.16
  Inner2 w0.254: 18.23,69.11 18.23,70.8 17.47,71.56 17.47,74.76 18.34,75.63 3.86,90.1
  vias: v1(18.34,69.11)
GPIO7: length 25.6
  Top Layer w0.229: 19.41,69.41 19.96,69.97 v1(19.96,69.98)
  Inner2 w0.254: 4.32,84.64 5.9,83.06 5.9,80.08 17.58,68.4 18.45,68.4 18.92,68.87 18.92,68.93 v1(19.96,69.98)
GPIO8: length 21.4
  Top Layer w0.254: 20.02,68.88 19.35,68.21 19.35,67.89
  Inner2 w0.254: 19.35,67.79 16.58,67.79 4.32,80.05
  vias: v1(19.35,67.84)
GPIO9: length 20.9
  Top Layer w0.254: 20,67.37 20,67.32 ; 20,67.37 19.97,67.39 19.97,68.24 19.99,68.25 ; 20,67.37 19.96,67.34 ; 20.31,68.6 20,68.29
  Inner2 w0.254: 4.32,75.1 7.02,75.1 15.49,66.62 19.3,66.62 v1(19.96,67.28)
GPIO13: length 32.9
  Top Layer w0.254: v1(26.52,39.95) 26.46,40.01 BMP581.6 ; U1.12 20,65.46 v1(19.1,65.46)
  Inner1 w0.254: v1(26.52,39.95) 26.52,40.06 25.58,41 25.58,49.21 19.25,55.54 v1(19.25,55.75)
  Inner2 w0.254: v1(19.1,65.46) 19.1,55.91 v1(19.25,55.75)
GPIO16: length 35.3
  Top Layer w0.229: v1(22.75,64.64) 22.53,64.86 22.53,65.73 22.85,66.05
  Top Layer w0.254: v1(26.67,34.97) 26.55,35.09 25.94,35.09 ; v1(25.86,38.53) 25.86,38.89 BMP581.5
  Inner3 w0.254: v1(22.75,64.64) 22.14,64.03 22.14,53.83 23.14,52.83 23.14,51.51 24.05,50.59 24.05,41.45 25.71,39.8 25.71,38.58 ; v1(26.67,34.97) 26.67,37.72 v1(25.86,38.53)
GPIO17: length 37.3
  Top Layer w0.229: 23.47,67.56 23.47,66.07 23.08,65.68
  Top Layer w0.254: BMI270.12 24.26,35.25 24.36,35.34 v1(24.36,35.53)
  Inner1 w0.254: v1(24.36,35.53) 20.83,39.06 v1(20.83,45.03)
  Inner2 w0.254: v1(21.28,54.53) 21.28,45.49 v1(20.83,45.03)
  Inner3 w0.229: 21.23,54.53 21.34,54.64 21.34,63.99 23.47,66.12 23.47,67.61
  vias: v1(23.52,67.61)
GPIO18: length 90.3
  Top Layer w0.229: v1(25.08,35.64) 25.08,35.57 24.85,35.33 24.85,35.01 BMI270.13 ; 23.42,65.45 24,66.03 v1(24,66.98)
  Top Layer w0.254: BMP581.2 23.99,39.89 23.06,38.97 v1(23.06,38.58)
  Inner1 w0.254: v1(27.03,77.7) 26.55,77.23 26.55,73.62 v1(22.71,69.77) ; v1(32.61,65.71) 34.95,63.37 34.95,57.94 v1(33.07,56.06) ; v1(25.08,35.64) 25.08,36.56 v1(23.06,38.58)
  Inner2 w0.254: v1(25.08,35.64) 25.44,35.99 27.26,35.99 27.76,35.49 34.96,35.49 38.41,38.94 38.41,39.19 37.77,39.83 37.77,51.36 v1(33.07,56.06) ; v1(32.61,65.71) 38.05,71.15 v1(38.91,71.15)
  Inner3 w0.254: v1(22.71,69.77) 22.71,69.17 24.05,67.83 24.05,67.39 24,67.34 v1(24,66.98) ; v1(27.03,77.7) 32.36,77.7 v1(38.91,71.15)
GPIO19: length 40.9
  Top Layer w0.229: 23.7,65.22 23.7,65.2 23.31,64.82 v1(23.31,64.27)
  Top Layer w0.254: v1(27.22,34.42) 26.91,34.11 25.55,34.11 25.3,34.37 25.3,34.89 BMI270.14 ; BMP581.4 24.84,39.41 24.84,39.1 v1(25.17,38.76)
  Inner2 w0.254: v1(22.96,59.31) 22.96,57.94 18.14,53.11 v1(18.14,46.2)
  Inner3 w0.254: v1(27.22,34.42) 26.9,34.42 26.89,34.41 26.45,34.41 26.14,34.73 26.14,35.55 25.17,36.52 v1(25.17,38.76) 25.17,39.17 v1(18.14,46.2) ; v1(23.31,64.27) 23.31,61.14 23.32,61.14 23.32,59.67 v1(22.96,59.31)
GPIO20: length 33.9
  Top Layer w0.254: v1(27.33,35.08) 27.33,35.52 26.35,36.5 26.02,36.5 25.94,36.59 ; 23.98,64.89 23.95,64.86 v1(23.95,64.03)
  Inner1 w0.254: v1(23.95,64.03) 24.44,64.03 v1(27.13,61.34)
  Inner3 w0.254: v1(27.33,35.08) 27.33,37.78 27.51,37.96 27.51,60.96 v1(27.13,61.34)
GPIO21: length 28.1
  Top Layer w0.254: BMP581.7 26.31,40.51 v1(26.57,40.77) ; v1(23.93,63.37) 25.3,63.37 25.81,63.88 25.81,64.6 25.52,64.89
  Inner1 w0.254: v1(26.57,40.77) 26.57,41.79 25.93,42.43 25.93,49.68 v1(23.82,51.79)
  Inner2 w0.254: v1(23.82,51.79) 23.82,60.89 v1(23.85,60.92)
  Inner3 w0.254: v1(23.93,63.37) 23.93,61 v1(23.85,60.92)
GPIO23: length 25.4
  Top Layer w0.229: v1(26.59,64.49) 26.59,64.87 26.47,65 26.47,65.1 26.11,65.45
  Inner2 w0.254: v1(26.59,64.49) 26.59,64.31 27.28,63.63 33.99,63.63 45.59,75.23
GPIO24: length 26.6
  Top Layer w0.229: v1(25.82,66.27) 25.87,66.33 26.35,66.33 26.66,66.02 26.68,66.02
  Inner2 w0.254: v1(25.82,66.27) 31.64,66.27 45.59,80.23
GPIO25: length 27.9
  Top Layer w0.229: v1(26.25,66.91) 26.35,66.91 26.96,66.3
  Inner2 w0.254: v1(26.25,66.91) 27.28,66.91 45.59,85.23
GPIO26: length 31.6
  Top Layer w0.229: 27.19,66.58 26.89,66.89 26.89,67.33 26.72,67.5
  Inner2 w0.254: 45.59,90.23 26.77,71.41 v1(26.77,67.5)
MISO: length 59.6
  Top Layer w0.229: 21.44,67.48 21.75,67.79 21.99,67.79 22.01,67.77 22.62,67.77
  Inner1 w0.254: v1(37.03,63.93) 32.51,68.45 23.35,68.45 v1(22.62,67.72)
  Inner2 w0.254: v1(37.03,63.93) 42.22,58.75 42.22,31.57 45.59,28.19 45.59,27.86
  Bottom Layer w0.254: v1(37.03,63.93) 36.77,63.67 35.68,63.67 TF2.7
MOSI: length 43.5
  Top Layer w0.229: 22.93,67.06 22.81,66.94 22.59,66.94 22.28,66.63
  Inner2 w0.254: v1(22.93,67.01) 31.09,58.85 v1(33.68,58.85)
  Inner3 w0.254: 45.59,37.86 36.37,47.08 36.58,47.29 37,47.29 37.31,47.61 37.31,48.05 36.47,48.88 v1(36.47,58.83)
  Bottom Layer w0.254: v1(33.68,58.85) 35.16,58.85 TF2.3 36.45,58.8 v1(36.47,58.83)
NEOIN: length 54.6
  Top Layer w0.254: U40.4 37.66,39.64 v1(37.19,40.11) ; 18.81,71.01 18.81,71.58 18.61,71.78
  Inner1 w0.254: v1(18.81,71.06) 18.76,71.06 18.01,70.31 17.34,70.31 15.39,68.36 15.39,65.96 v1(15.44,65.91)
  Inner2 w0.254: 15.44,65.81 15.44,44.88 15.82,44.5 21.05,44.5 21.23,44.68 32.72,44.68 37.19,40.21 v1(37.19,40.11)
PISTA: length 25.4
  Top Layer w0.229: 18.89,72.11 18.45,72.55 v1(18.16,72.55)
  Top Layer w0.254: v1(17.17,60.63) 23.38,60.63 27.12,56.9
  Inner3 w0.254: v1(17.17,60.63) 17.17,67.19 18.92,68.94 18.92,69.36 18.16,70.12 v1(18.16,72.55)
PWM1: length 88.4
  Top Layer w0.229: 30.36,69.69 30.12,69.93 30.11,69.93 30.03,70 29.8,70 29.52,70.28 v1(28.61,70.28)
  Inner3 w0.254: v1(28.61,70.28) 28.61,70.13 28.12,69.64 28.12,66.59 30.5,64.2 30.5,16.35 32.59,14.27 32.59,10.67 32.16,10.24 13.28,10.24 U37.3
  Inner4 w0.254: 9.75,6.6 9.78,6.58 9.88,6.58
PWM2: length 88.3
  Top Layer w0.229: v1(29.26,70.9) 29.71,70.9 30.64,69.98
  Inner3 w0.254: U37.6 13.06,7.47 13.06,8.81 13.24,8.99 31.83,8.99 33.07,10.24 33.07,21.32 32.61,21.78 32.61,22.22 32.92,22.53 32.92,55.38 32.49,55.82 32.49,56.3 33.07,56.88 33.07,65.34 33.2,65.47 33.2,65.95 29.99,69.16 29.46,69.16 29.28,69.34 29.28,70.88 v1(29.26,70.9)
PWM3: length 84.3
  Top Layer w0.254: v1(30.46,71.01) 30.92,70.55 30.92,70.26
  Inner3 w0.254: v1(30.46,71.01) 30.46,69.19 34.37,65.29 34.37,56.53 33.27,55.44 33.27,22.62 33.67,22.22 33.67,10.33 31.98,8.64 16.77,8.64 U37.9
PWM4: length 77.4
  Top Layer w0.229: v1(29.86,71.48) 30.01,71.48 30.64,72.11
  Inner4 w0.254: 17.27,6.55 16.19,5.47 14.28,5.47 13.65,6.11 13.65,7.49 29.88,23.72 29.88,71.41 29.86,71.43
PWM5: length 68.9
  Top Layer w0.229: v1(29.26,71.98) 29.53,71.98 29.62,72.07 30.03,72.07 30.36,72.39
  Inner4 w0.254: 32.59,6.6 32.59,21.68 31.14,23.12 31.14,71.4 30.56,71.98 30.14,71.98 30.05,72.07 29.3,72.07 29.21,71.98
PWM6: length 69.2
  Top Layer w0.229: v1(30.76,73.1) 30.64,72.98 30.38,72.98 30.07,72.68
  Inner4 w0.254: v1(30.76,73.1) 35.18,68.69 U38.6
PWM7: length 73
  Top Layer w0.229: 29.79,72.96 30.1,73.27 30.1,73.51 30.07,73.54 v1(30.07,73.84)
  Inner4 w0.254: v1(30.07,73.84) 29.97,73.84 ; 37.77,6.6 37.72,6.66 37.72,57.95 37.87,58.1 37.87,67.67 31.09,74.45 30.84,74.45 30.23,73.84
PWM8: length 79.7
  Top Layer w0.229: 29.51,73.24 29.2,72.93 29.17,72.93 v1(28.91,72.67)
  Inner4 w0.254: v1(28.91,72.67) 29.49,73.25 29.49,74.08 30.57,75.16 31.6,75.16 40.39,66.37 40.39,18.47 40.57,18.28 40.87,18.28 arc(42.01,17.62) 42.46,16.38 42.46,15.77 42.41,15.72 arc(41.96,14.48) 40.82,13.83 40.7,13.71 40.26,13.71 U38.12
QSPI_SCLK: length 31.8
  Top Layer w0.229: 21.15,74.32 21.17,74.32 21.5,73.99 22.05,73.99
  Top Layer w0.254: U7.6 28.27,47.02 v1(26.47,47.02)
  Inner3 w0.254: 22.1,74.04 25.25,70.89 25.25,48.18 26.42,47.02 26.52,47.02
  vias: v1(22.05,74.04)
QSPI_SD1: length 31.8
  Top Layer w0.229: 20.31,73.47 20.31,73.49 19.8,73.99 19.51,73.99
  Top Layer w0.254: v1(23.06,48.39) 22.99,48.31 21.24,48.31
  Inner3 w0.254: 22.96,48.49 18.09,53.37 18.09,67.6 19.01,68.53 19.11,68.53 19.38,68.8 19.43,68.8 19.43,70.82 20.22,71.6 20.22,73.48 19.56,74.14
  vias: v1(19.51,74.04)
QSPI_SD2: length 31.6
  Top Layer w0.229: 20.59,73.81 20.9,73.5 20.92,73.5 v1(21.21,73.21)
  Top Layer w0.254: v1(23.01,46.97) 22.94,47.04 21.24,47.04
  Inner3 w0.254: v1(21.21,73.21) 21.87,72.55 21.87,67.43 20.75,66.32 20.75,53.34 23.6,50.5 23.6,47.96 23.52,47.89 23.52,47.22 23.06,46.76 22.91,46.76 22.81,46.66
QSPI_SD3: length 34.7
  Top Layer w0.229: v1(20.68,75.11) 20.98,75.11 21.44,74.66
  Top Layer w0.254: U7.7 28.23,48.25 v1(26.47,48.25)
  Inner3 w0.254: v1(20.68,75.11) 20.76,75.19 22.88,75.19 27.46,70.61 27.46,66.18 26.01,64.73 26.01,64.25 26.47,63.79 v1(26.47,48.25)
QSPI_SDO: length 35
  Top Layer w0.254: 20.87,74.06 20.5,74.42 20.15,74.42 19.97,74.6 ; v1(26.47,45.82) 26.51,45.77 U7.5
  Inner3 w0.254: 26.47,45.87 24.59,47.75 24.59,70.89 21.97,73.51 21.81,73.51 20.79,74.52 20.15,74.52 19.97,74.7
  vias: v1(19.97,74.65)
QSPI_SS: length 39.4
  Top Layer w0.229: 20.02,73.24 20.59,72.67 v1(20.78,72.67)
  Top Layer w0.254: v1(20.12,52.1) 20.12,51.02 R18.1 21.24,49.9 21.24,49.58 ; R16.2 6.5,51.18 v1(6.91,51.59)
  Inner1 w0.254: v1(20.12,52.1) 19.61,51.59 v1(6.91,51.59)
  Inner3 w0.254: v1(20.78,72.67) 20.78,71.31 20.65,71.18 20.65,66.92 20.32,66.59 20.32,52.1
RPD+: length 5.4
  Top Layer w0.254: R4.1 10.11,64.71 USB1.8 6.61,64.71 6.25,65.06 6.25,65.35 6.54,65.64 7.13,65.64 USB1.6
RPD-: length 4.7
  Top Layer w0.254: 8.14,66.22 8.13,66.21 8.13,65.41 7.93,65.21 USB1.7 ; 8.14,66.22 7.21,66.22 USB1.5 ; 8.14,66.22 R3.1
SCL: length 33.5
  Inner2 w0.254: 4.32,27.78 18.16,27.78 19.7,26.24 v1(24.33,26.24)
  Bottom Layer w0.254: U43.9 32.33,26.24 v1(24.33,26.24)
SDA: length 32.8
  Inner2 w0.254: 4.32,22.78 25.92,22.78 28.15,25.02 v1(32.06,25.02)
  Bottom Layer w0.254: U43.8 32.96,24.12 v1(32.06,25.02)
SDCS: length 25
  Top Layer w0.229: 18.89,70.03 19.47,70.61 19.94,70.61 20.07,70.74
  Inner2 w0.254: v1(33.68,57.68) 33.63,57.68 33.32,57.99 27.74,57.99 20.68,65.05 20.68,70.14 20.26,70.56 20.19,70.56 v1(20.07,70.69)
  Bottom Layer w0.254: v1(33.68,57.68) 33.7,57.7 TF2.2
XIN: length 19.3
  Top Layer w0.127: 28.09,67.43 27.89,67.64 27.78,67.64 27.4,68.02 26.28,68.02 v1(25.91,67.64)
  Inner2 w0.254: v1(25.91,67.64) 25.91,71.91 26.52,72.52 v1(26.82,72.52)
  Bottom Layer w0.254: v1(25.91,67.64) 25.91,67.6 C33.2 ; 33.8,76.42 31.29,73.91 31.29,72.88 30.93,72.52 29.81,72.52 29.13,73.2 28.68,73.2 28,72.52 v1(26.82,72.52)
XOUT: length 9.2
  Top Layer w0.229: v1(28.65,66.81) 28.65,67.13 28.69,67.16 28.69,67.41 28.38,67.72
  Bottom Layer w0.254: v1(28.65,66.81) 28.83,66.81 R17.1
$3N4153: length 19.2
  Top Layer w0.254: BMM350.C2 24.79,31.46 24.79,30.92 v1(24.94,30.76)
  Inner2 w0.254: v1(32.11,42.39) 27.31,37.59 25.07,37.59 23.82,36.35 23.82,33.62 24.94,32.5 v1(24.94,30.76)
  Bottom Layer w0.254: C39.1 33.46,42.39 v1(32.11,42.39)
$3N4271: length 12.7
  Top Layer w0.254: BMM350.C1 24.37,31 v1(24.25,30.89)
  Inner1 w0.254: v1(19.81,24.36) 19.81,26.45 v1(24.25,30.89)
  Bottom Layer w0.254: v1(19.81,24.36) 19.75,24.36 C46.2 C40.1
$3N4404: length 2.1
  Top Layer w0.254: 25.16,32.28 25.41,32.52 v1(25.68,32.52)
  Bottom Layer w0.254: v1(25.68,32.52) 25.68,33.65 R22.2
$3N4443: length 5.1
  Top Layer w0.254: 24.79,32.28 24.79,32.59 24.19,33.19 v1(22.09,33.19)
  Bottom Layer w0.254: R23.2 22.85,33.19 v1(22.09,33.19)
$3N5055: length 11.3
  Top Layer w0.254: 24.37,32.28 23.86,32.28 23.83,32.25 22.95,32.25 v1(22.61,32.59)
  Inner1 w0.254: v1(19.05,26.14) 19.46,26.54 19.46,29.44 v1(22.61,32.59)
  Bottom Layer w0.254: 18.53,24.87 19.05,25.39 v1(19.05,26.14)
$3N22326: length 1.9
  Top Layer w0.254: v1(29.26,22.33) 29.21,22.28 BUZZER.3
  Bottom Layer w0.254: v1(29.26,22.33) 30.09,22.33 Q3.3
$3N22330: length 2.1
  Bottom Layer w0.254: Q3.1 32.18,23.18 R26.2
$3N25090: length 3.2
  Inner1 w0.254: v2(19.51,4.78) 21.48,6.76 v2(21.48,7.19)
$3N25501: length 10.3
  Inner1 w0.508: v1(41.63,8.92) 41.55,8.84 41.55,4.8 v1(43.54,2.82)
  Bottom Layer w0.254: Q1.3 41.63,9.48 v1(41.63,8.92)
  Bottom Layer w0.508: 45.59,2.78 43.57,2.78 v1(43.54,2.82)
$3N25503: length 1.6
  Bottom Layer w0.254: Q1.1 39.12,9.02 R24.2
$3N26223: length 3.1
  Bottom Layer w0.254: R25.2 12.19,11.84 12.19,11.34 12.19,11.34 11.57,11.34 10.75,12.15 Q2.1
$3N26229: length 15.2
  Inner1 w0.254: v1(5.39,1.14) 5.39,9.1 v1(8.5,12.22)
  Bottom Layer w0.254: v1(5.39,1.14) 4.32,2.21 4.32,2.78 ; 8.75,11.61 8.75,11.96 v1(8.5,12.22)
$3N29548: length 9.8
  Top Layer w0.254: v2(21.02,20.49) 21.18,20.49 v2(26.47,15.2)
  Bottom Layer w0.254: v2(26.47,15.2) 25.75,14.48 U45.1 ; C47.2 21.02,19.54 v2(21.02,20.49)
$3N29821: length 77.6
  Inner1 w0.254: v1(28.35,17.81) 28.56,18.02 28.56,48.06 11.27,65.35 11.27,81.62 v1(8.76,84.12)
  Bottom Layer w0.254: v1(8.76,84.12) 9.09,84.12 U17.2 ; v1(28.35,17.81) 28.19,17.64 26.59,17.64
$3N29823: length 106.1
  Inner1 w0.254: v1(26.29,22.4) 25.58,22.4 24.94,23.04 16.05,23.04 1.07,38.02 1.07,79.9 2.85,81.68 4.08,81.68 8.92,86.51 15.26,86.51 16.35,87.61 20.68,87.61 21.18,87.1 21.39,87.3 v1(21.39,87.81)
  Bottom Layer w0.254: v1(26.29,22.4) 26.42,22.28 26.42,20.38 26.13,20.1 25.83,20.1 24.75,19.02 24.75,18.18 24.17,17.59 24.02,17.59 23.9,17.72 ; U18.1 21.34,86.64 21.95,87.25 v1(21.39,87.81)
$3N29825: length 102.3
  Inner1 w0.254: v1(31.29,12.62) 31.29,13.18 31.19,13.28 30.99,13.28 21.59,22.68 11.71,22.68 0.61,33.78 0.61,79.97 3.49,82.85 3.64,82.85 5.9,85.11 5.9,85.68 8.13,87.91 8.79,87.91 v1(8.84,87.86)
  Bottom Layer w0.254: v1(8.84,87.86) 9.69,87.01 U16.2 ; v1(31.29,12.62) 32.48,12.62 33.71,13.86
$3N29827: length 82
  Inner3 w0.254: v1(19.3,83.08) 19.3,78.3 14.22,73.22 14.22,32.03 27.89,18.36 28.61,18.36 28.93,18.05 28.93,17.17 v1(32.06,14.05)
  Bottom Layer w0.254: 21.2,83.29 20.99,83.08 v1(19.3,83.08) ; v1(32.06,14.05) 31.87,13.86 31.11,13.86
$3N29841: length 12.1
  Inner1 w0.254: v2(24.32,12.73) 23.89,13.16 23.89,13.31 23.55,13.66 23.4,13.66 19.66,17.39 v2(19.66,20.41)
  Bottom Layer w0.254: U45.2 25.1,12.73 v2(24.32,12.73) ; C47.1 19.66,19.58 v2(19.66,20.41)
$3N29881: length 2.4
  Bottom Layer w0.254: R27.1 20.04,8.31 R28.1 ; U45.5 20.04,9.58
$5N714: length 16
  Top Layer w0.229: v1(22.64,74.61) 22.88,74.84 22.88,75.46 22.57,75.77 22.57,75.79
  Top Layer w0.254: R3.2 11.64,66.21 v1(12.74,66.21)
  Inner1 w0.254: v1(12.74,66.21) 15.04,68.5 15.04,68.51 17.19,70.66 17.2,70.66 21.24,74.71 22.64,74.71
$5N753: length 19.1
  Top Layer w0.229: v1(21.55,75.94) 21.85,75.94 22.28,75.5
  Top Layer w0.254: R4.2 v1(12.75,64.69)
  Inner1 w0.254: v1(21.55,75.94) 19.5,75.94 11.63,68.07 11.63,65.82 v1(12.75,64.69)
$5N865: length 2.9
  Top Layer w0.254: USB1.4 6.61,66.71 6.59,66.73 v1(5.79,66.73)
  Bottom Layer w0.254: R12.1 4.45,66.73 v1(5.79,66.73)
$5N907: length 2.9
  Top Layer w0.254: v1(5.79,63.69) 7.19,63.69 USB1.10
  Bottom Layer w0.254: 5.74,63.68 5.71,63.71 R13.1
$5N1500: length 48.4
  Top Layer w0.229: 23.88,75.87 23.88,76.12 23.42,76.58
  Inner1 w0.254: v1(33.83,44.78) 33.83,52.19 20.34,65.68 20.34,66.67 20.8,67.13 20.8,68.93 23.88,72 v1(23.88,75.92)
  Bottom Layer w0.254: L3.1 28.56,42.37 29.57,43.38 32.43,43.38 v1(33.83,44.78)
$5N1577: length 48.7
  Top Layer w0.254: v1(24.76,76.71) 24.54,76.94 24.25,76.94 23.98,77.2
  Bottom Layer w0.254: 25.54,76.24 25.54,69.48 27.3,67.72 27.3,67.01 24.89,64.59 24.89,55.3 36.92,43.27 36.92,42.02 C32.1 ; 25.54,76.24 25.08,76.71 v1(24.76,76.71) ; 25.54,76.24 R14.2
$5N3555: length 34.8
  Top Layer w0.254: U1.35 28.91,69.42 v1(28.65,69.42) ; R15.2 31.68,56.5 v1(32,56.82)
  Inner1 w0.254: v1(32,56.82) 32,58.66 34.37,61.02 34.37,61.46 32,63.82 32,66.32 33.89,66.32 36.81,63.4 37.25,63.4 37.57,63.71 37.57,64.15 32.3,69.42 v1(28.65,69.42)
$5N4153: length 2.1
  Top Layer w0.254: LED-RUN.1 35.6,47.83 v1(36.78,47.83)
  Bottom Layer w0.254: D4.1 v1(36.78,47.83)
$5N4199: length 4
  Top Layer w0.254: LED-QSPI_SS.1 14.81,47.81 16.42,49.42 D3.1
$5N4367: length 8.2
  Top Layer w0.254: v1(34.62,31.34) 34.62,30.54 v1(34.14,30.05)
  Bottom Layer w0.254: LED6.1 33.43,32.54 v1(34.62,31.34) ; v1(34.14,30.05) 31.97,27.88 D5.1
$5N4916: length 5.3
  Bottom Layer w0.254: C34.2 37.81,72.96 36.02,74.74 U6.1 36,72.46 R17.2
$5N10092: length 1.9
  Top Layer w0.254: QSPI_SS.3 4.39,51.24 R16.1
$5N10100: length 2.2
  Top Layer w0.254: D3.2 13.39,51.42 QSPI_SS.4
$5N12881: length 3.3
  Top Layer w0.254: RUN.3 36.49,53.08 R15.1
$5N12933: length 7.3
  Top Layer w0.254: v1(41.22,49.25) 41.72,49.25 RUN.4
  Bottom Layer w0.254: D4.2 41.22,47.89 v1(41.22,49.25)
$5N18524: length 56.9
  Top Layer w0.254: v1(27.98,36.28) 31.93,36.28 U40.2 ; v1(28.32,85.82) 27.99,86.16 27.09,86.16
  Inner4 w0.254: v1(27.98,36.28) 27.98,64.31 28.07,64.4 28.07,64.89 27.98,64.97 27.98,72.57 28.83,73.42 28.83,76.32 28.32,76.83 v1(28.32,85.82)
$5N18586: length 47.3
  Top Layer w0.254: 16.68,38.46 16.68,40.19 v1(16.41,40.46)
  Inner3 w0.254: v1(16.41,40.46) 16.41,74.91 23.27,81.76 v1(23.27,82.83)
$5N24177: length 2.1
  Top Layer w0.254: v1(8.23,67.84) 8.22,67.86 USB1.2
  Bottom Layer w0.254: 9.27,67.84 v1(8.23,67.84)
$5N24251: length 2
  Top Layer w0.254: USB1.11 v1(8.14,63.06)
  Bottom Layer w0.254: 9.27,63.07 8.18,63.07

## Text on the board
Bottom Silkscreen Layer: C43 | C46 | C44 | C47 | C45 | 3.3V | 5V | GND | 36V | 1.8V | TX | RX | 12V | SCL | SDA | PYRO1 | ADC4 | ADC3 | 1 | 2 | 3 | 4 | 5 | 6 | 7 | 23 | 26 | 24 | 25 | CS | CLK | MISO | MOSI | ADC2 | PYRO2 | GPIO | 09 | 06 | 08 | 07
Top Silkscreen Layer: 06 | 07 | 08 | 09 | ADC4 | ADC3 | SCL | RX | SDA | TX | P / W / M / 1 | P / W / M / 2 | P / W / M / 3 | P / W / M / 4 | 36V | GND | P / W / M / 5 | P / W / M / 6 | P / W / M / 7 | ADC2 | MISO | MOSI | 3.3V | CLK | CS | P / W / M / 8 | 23 | 24 | 26 | 25 | GPIO | Avian
